# EAGLE design Etch-a-sketch (EAGLE 9.6.2)
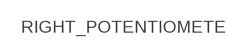
[diagram p0: schematic, sheet 1, part 1 of 2]
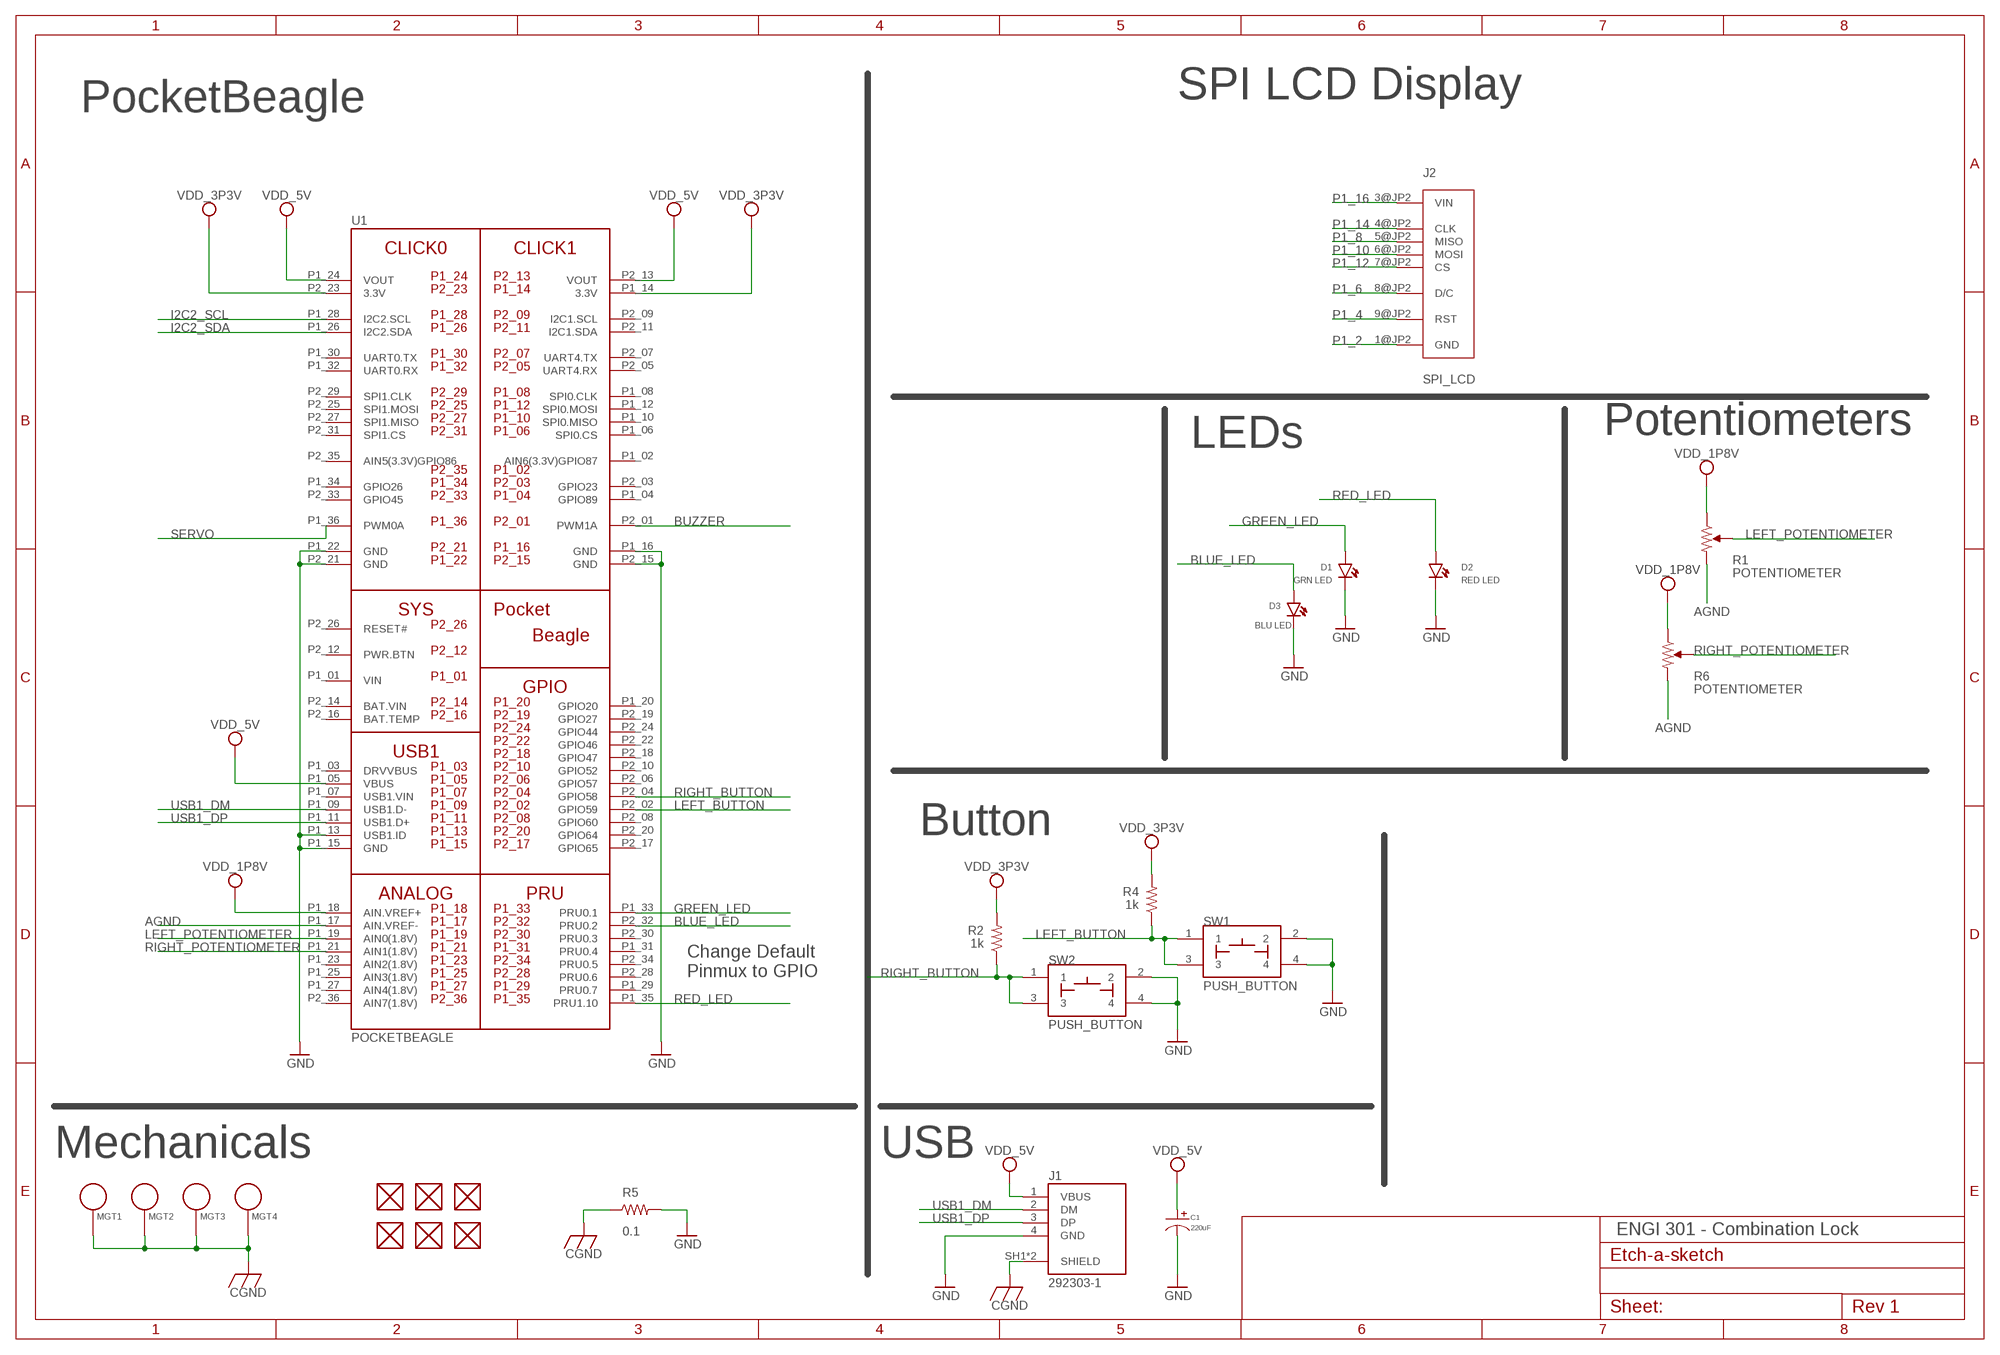
[diagram p1: schematic, sheet 1, part 2 of 2]

## Parts
C1  220uF  CAPACITOR_P_10MM  [CP10MM]
D1  GRN LED  LED  [EIA-STD]
D2  RED LED  LED  [EIA-STD]
D3  GRN LED  LED  [EIA-STD]
FUD1  FIDUCIAL  [FIDUCIAL_40MIL]
FUD2  FIDUCIAL  [FIDUCIAL_40MIL]
FUD3  FIDUCIAL  [FIDUCIAL_40MIL]
FUD4  FIDUCIAL  [FIDUCIAL_40MIL]
FUD5  FIDUCIAL  [FIDUCIAL_40MIL]
FUD6  FIDUCIAL  [FIDUCIAL_40MIL]
J1  292303-1  [TE_292303-1]
J2  SPI_LCD  [TFT_LCD_PCB]
MGT1  MOUNTING_HOLE  [MOUNTING_HOLE]
MGT2  MOUNTING_HOLE  [MOUNTING_HOLE]
MGT3  MOUNTING_HOLE  [MOUNTING_HOLE]
MGT4  MOUNTING_HOLE  [MOUNTING_HOLE]
R1  POTENTIOMETER  [POT-PO90S]
R2  1k  R_R0603  [R0603]
R4  1k  R_R0603  [R0603]
R5  0.1  R_R0805  [R0805]
R6  POTENTIOMETER  [POT-PO90S]
SW1  PUSH_BUTTON  [BUTTON_12.5MM]
SW2  PUSH_BUTTON  [BUTTON_12.5MM]
U1  POCKETBEAGLE  [POCKETBEAGLE]

## Nets
AGND: R1.CW R6.CW U1.P1_17(AIN.VREF-)
AGND1: U1.P1_21(AIN1(1.8V))
BUTTON1: U1.P2_04(GPIO58)
BUZZER: U1.P2_01(PWM1A)
CGND: J1.SH1(SHIELD) J1.SH2(SHIELD) MGT1.P$1 MGT2.P$1 MGT3.P$1 MGT4.P$1 R5.1
GND: C1.P$2 D1.CATHODE D2.CATHODE D3.CATHODE J1.4(GND) R5.2 SW1.2 SW1.4 SW2.2 SW2.4 U1.P1_13(USB1.ID) U1.P1_15(GND) U1.P1_16(GND) U1.P1_22(GND) U1.P2_15(GND) U1.P2_21(GND)
GREEN_LED: D1.ANODE D3.ANODE U1.P1_33(PRU0.1)
GREEN_LED1: U1.P2_32(PRU0.2)
I2C2_SCL: U1.P1_28(I2C2.SCL)
I2C2_SDA: U1.P1_26(I2C2.SDA)
LEFT_BUTTON: R2.1 R4.1 SW1.1 SW1.3 SW2.1 SW2.3 U1.P2_02(GPIO59)
LEFT_POTENTIOMETER: R1.S R6.S U1.P1_19(AIN0(1.8V))
N$1: J2.3@JP2(VIN)
N$2: J2.4@JP2(CLK)
N$3: J2.5@JP2(MISO)
N$4: J2.6@JP2(MOSI)
N$5: J2.7@JP2(CS)
N$6: J2.8@JP2(D/C)
N$7: J2.9@JP2(RST)
N$8: J2.1@JP2(GND)
RED_LED: D2.ANODE U1.P1_35(PRU1.10)
SERVO: U1.P1_36(PWM0A)
USB1_DM: J1.2(DM) U1.P1_09(USB1.D-)
USB1_DP: J1.3(DP) U1.P1_11(USB1.D+)
VDD_1P8V: R1.CCW R6.CCW U1.P1_18(AIN.VREF+)
VDD_3P3V: R2.2 R4.2 U1.P1_14(3.3V) U1.P2_23(3.3V)
VDD_5V: C1.P$1 J1.1(VBUS) U1.P1_05(VBUS) U1.P1_24(VOUT) U1.P2_13(VOUT)
Unconnected: FUD1.P$1 FUD2.P$1 FUD3.P$1 FUD4.P$1 FUD5.P$1 FUD6.P$1 U1.P1_02(AIN6(3.3V)GPIO87) U1.P1_03(DRVVBUS) U1.P1_04(GPIO89) U1.P1_06(SPI0.CS) U1.P1_07(USB1.VIN) U1.P1_08(SPI0.CLK) U1.P1_10(SPI0.MISO) U1.P1_12(SPI0.MOSI) U1.P1_20(GPIO20) U1.P1_23(AIN2(1.8V)) U1.P1_25(AIN3(1.8V)) U1.P1_27(AIN4(1.8V)) U1.P1_29(PRU0.7) U1.P1_30(UART0.TX) U1.P1_31(PRU0.4) U1.P1_32(UART0.RX) U1.P1_34(GPIO26) U1.P2_03(GPIO23) U1.P2_05(UART4.RX) U1.P2_06(GPIO57) U1.P2_07(UART4.TX) U1.P2_08(GPIO60) U1.P2_09(I2C1.SCL) U1.P2_10(GPIO52) U1.P2_11(I2C1.SDA) U1.P2_12(PWR.BTN) U1.P2_16(BAT.TEMP) U1.P2_17(GPIO65) U1.P2_18(GPIO47) U1.P2_19(GPIO27) U1.P2_20(GPIO64) U1.P2_22(GPIO46) U1.P2_24(GPIO44) U1.P2_25(SPI1.MOSI) U1.P2_26(RESET#) U1.P2_27(SPI1.MISO) U1.P2_28(PRU0.6) U1.P2_29(SPI1.CLK) U1.P2_30(PRU0.3) U1.P2_31(SPI1.CS) U1.P2_33(GPIO45) U1.P2_34(PRU0.5) U1.P2_35(AIN5(3.3V)GPIO86) U1.P2_36(AIN7(1.8V))

## Notes on the sheet
- PocketBeagle | SPI LCD Display
- P1_16
- P1_14
- P1_8
- P1_10
- P1_12
- P1_6
- P1_4
- P1_2
- LEDs | Potentiometers
- BLUE_LED
- BLU LED
- RIGHT_POTENTIOMETER
- RIGHT_BUTTON
- Button
- BLUE_LED
- RIGHT_POTENTIOMETER
- Change Default 
  Pinmux to GPIO
- RIGHT_BUTTON
- Mechanicals | USB
- ENGI 301 - Combination Lock
- RIGHT_POTENTIOMETER

## Power pins joined to a net without a drawn wire
BAT.VIN: U1.P2_14(BAT.VIN)
VIN: U1.P1_01(VIN)

## Library data of the parts
C1 = combo_lock:CAPACITOR_P: Library: MF_Passives Description: Device for Polarized Capacitors. Manufacture part number (MPN), Voltage Rating, and Tolerance can be added via Attributes. Check https://factory.macrofab.com/parts for the house parts list.; POPULATE: 1
D1-D3 = combo_lock:LED: EIA-STD LED, LTST-C191TBKT
FUD1-FUD6 = combo_lock:FIDUCIAL
J1 = combo_lock:292303-1: CONN USB RECEPT R/A TYPE A 4POS Check availability <https://pricing.snapeda.com/parts/292303-1/TE%20Connectivity/view-part?ref=eda>; AVAILABILITY: In Stock; CENTERLINE_PITCH: 2 mm[.078 in]; COMMENT: 292303-1; DESCRIPTION: Conn; Data; USB; Recept; 2.0; 4 Pos; 1 Port; Rt Angle; A Ser; Tin over Copper; EU_ROHS_COMPLIANCE: Compliant; MF: TE Connectivity; MP: 292303-1; NUMBER_OF_POSITIONS: 4; PACKAGE: None; PRICE: None; PRODUCT_TYPE: Connector; PURCHASE-URL: https://pricing.snapeda.com/search/part/292303-1/?ref=eda
J2 = Etch-a-sketch:SPI_LCD
MGT1-MGT4 = combo_lock:MOUNTING_HOLE: Chassis Mounting Hole w/GND connection ability
R1 R6 = combo_lock:POTENTIOMETER: Potentiometer - Examples: P090S-14T20BR10K (987-1277-ND)
R2 R4 R5 = combo_lock:R_: RESISTOR, American symbol
SW1 SW2 = combo_lock:PUSH_BUTTON
U1 = combo_lock:POCKETBEAGLE

## Board
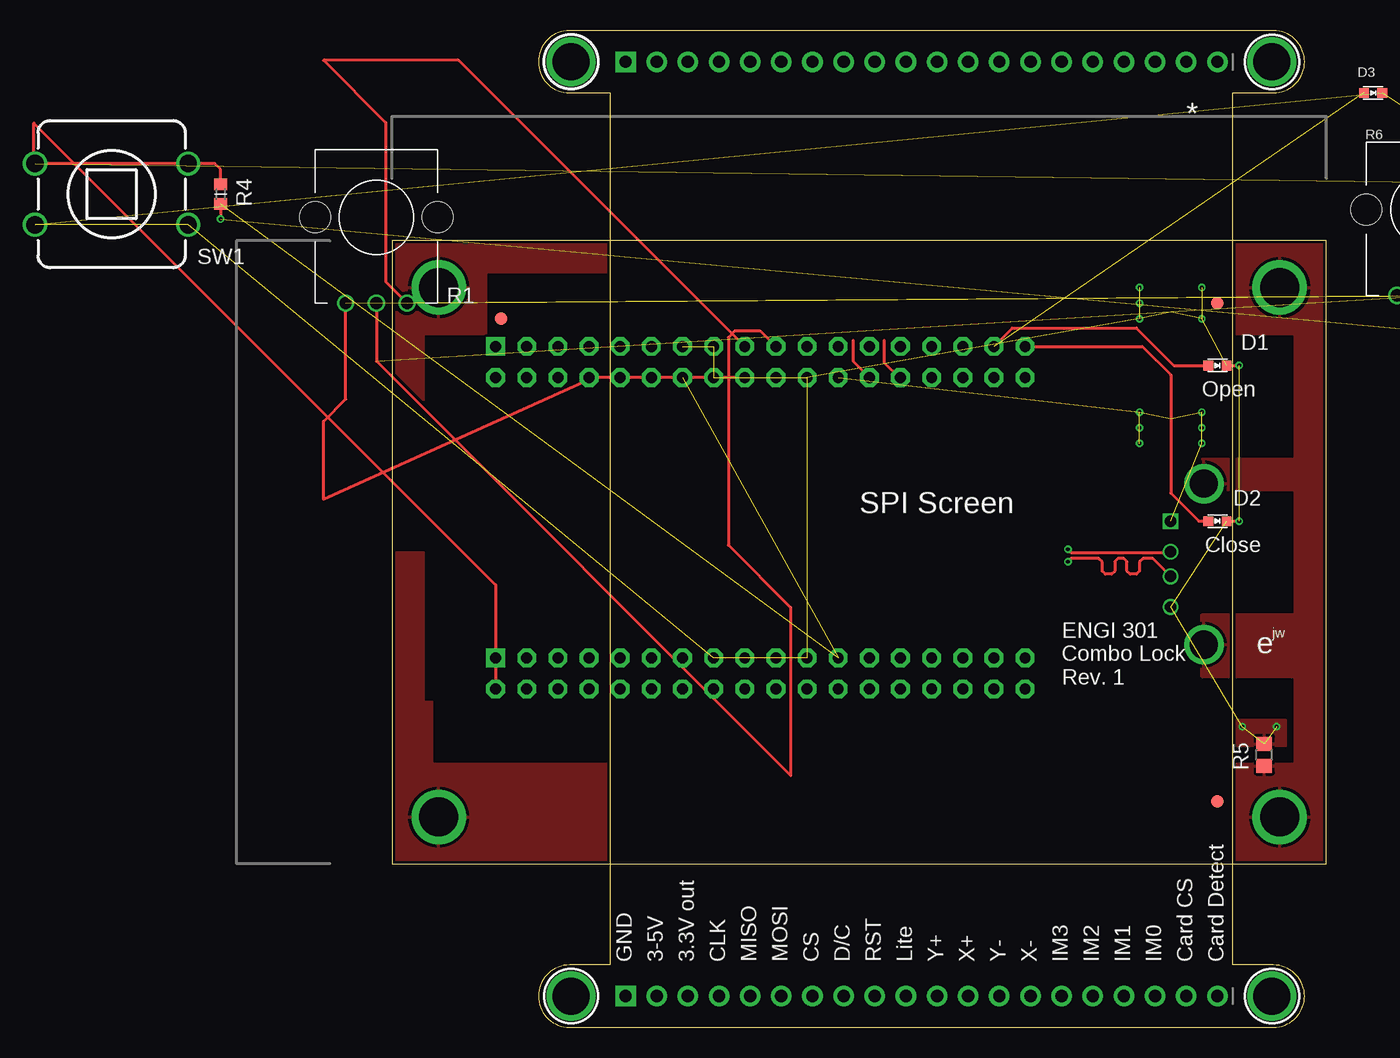
[diagram p2: board, top side]
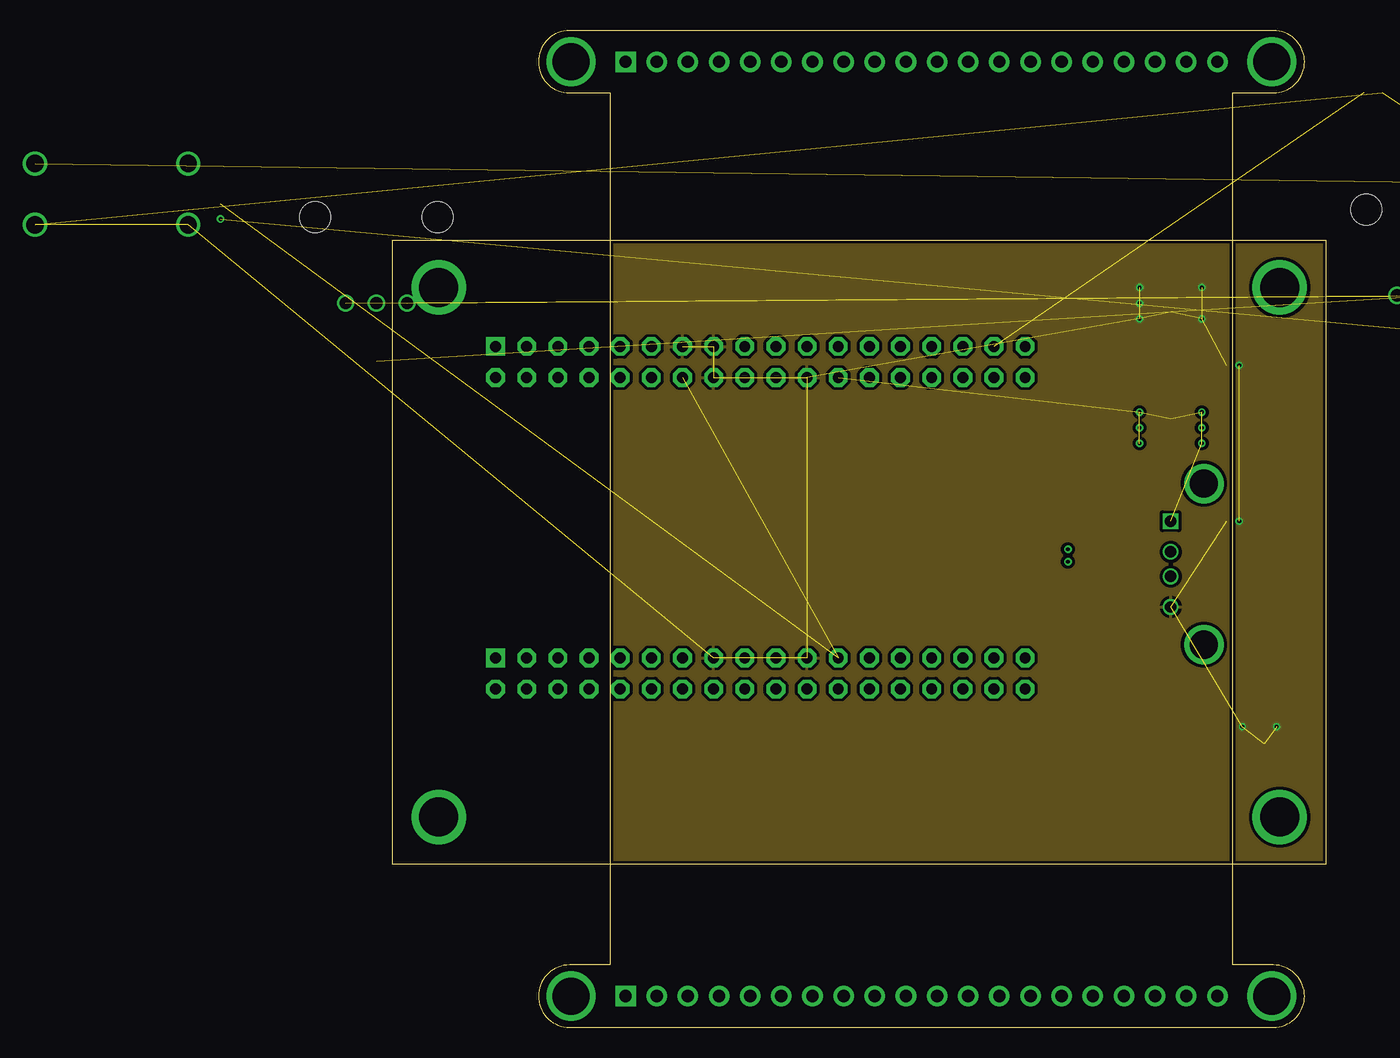
[diagram p3: board, inner layer Route2]
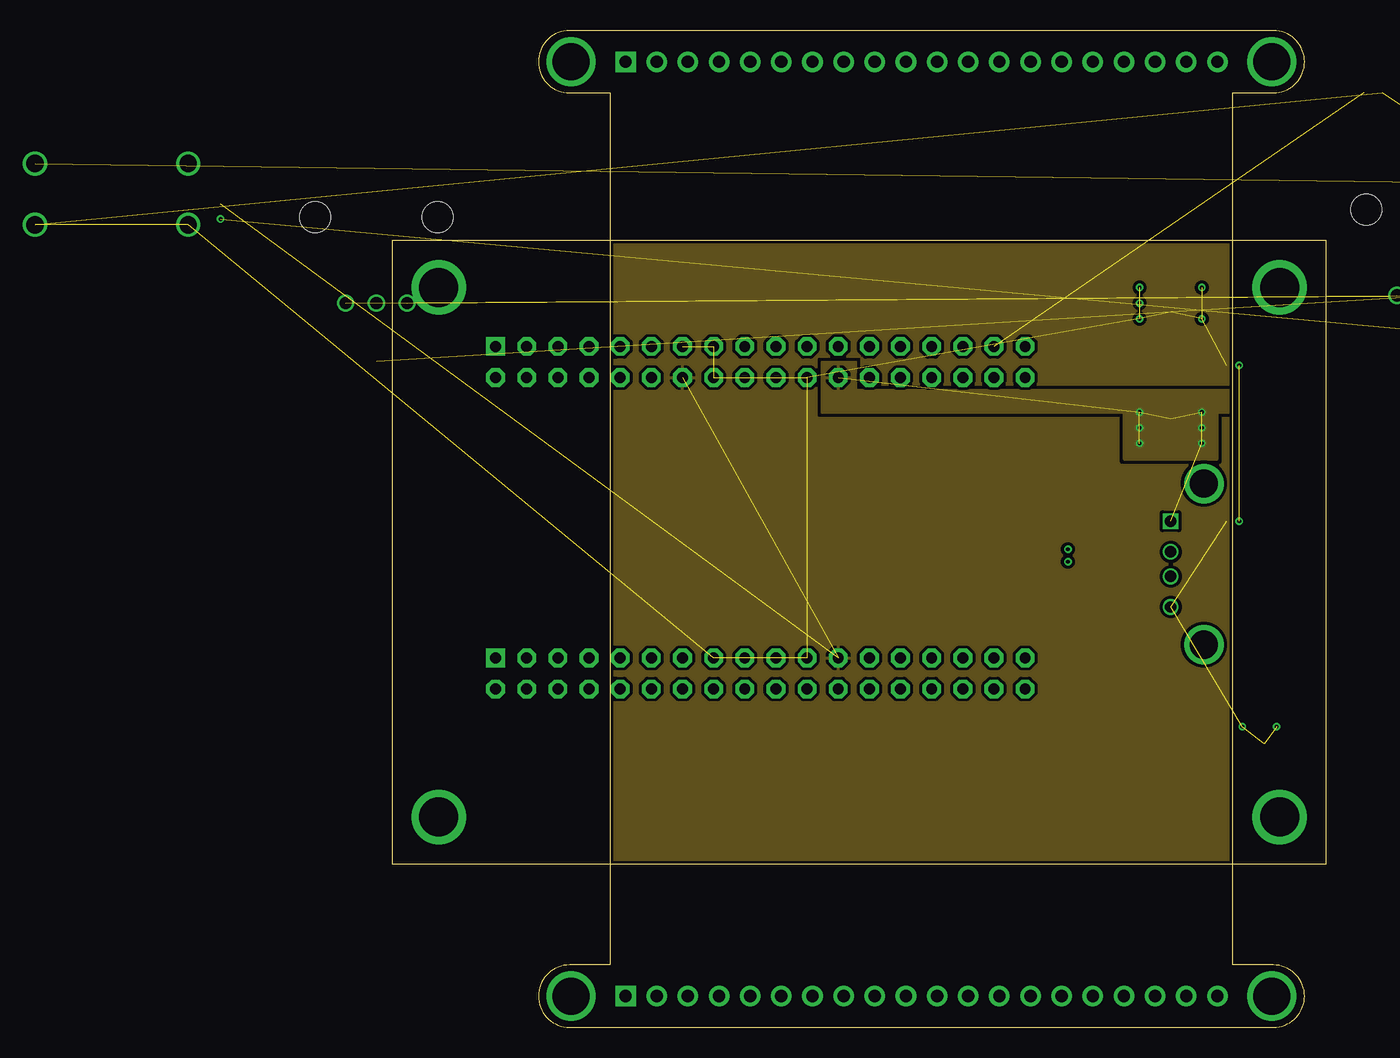
[diagram p4: board, inner layer Route15]
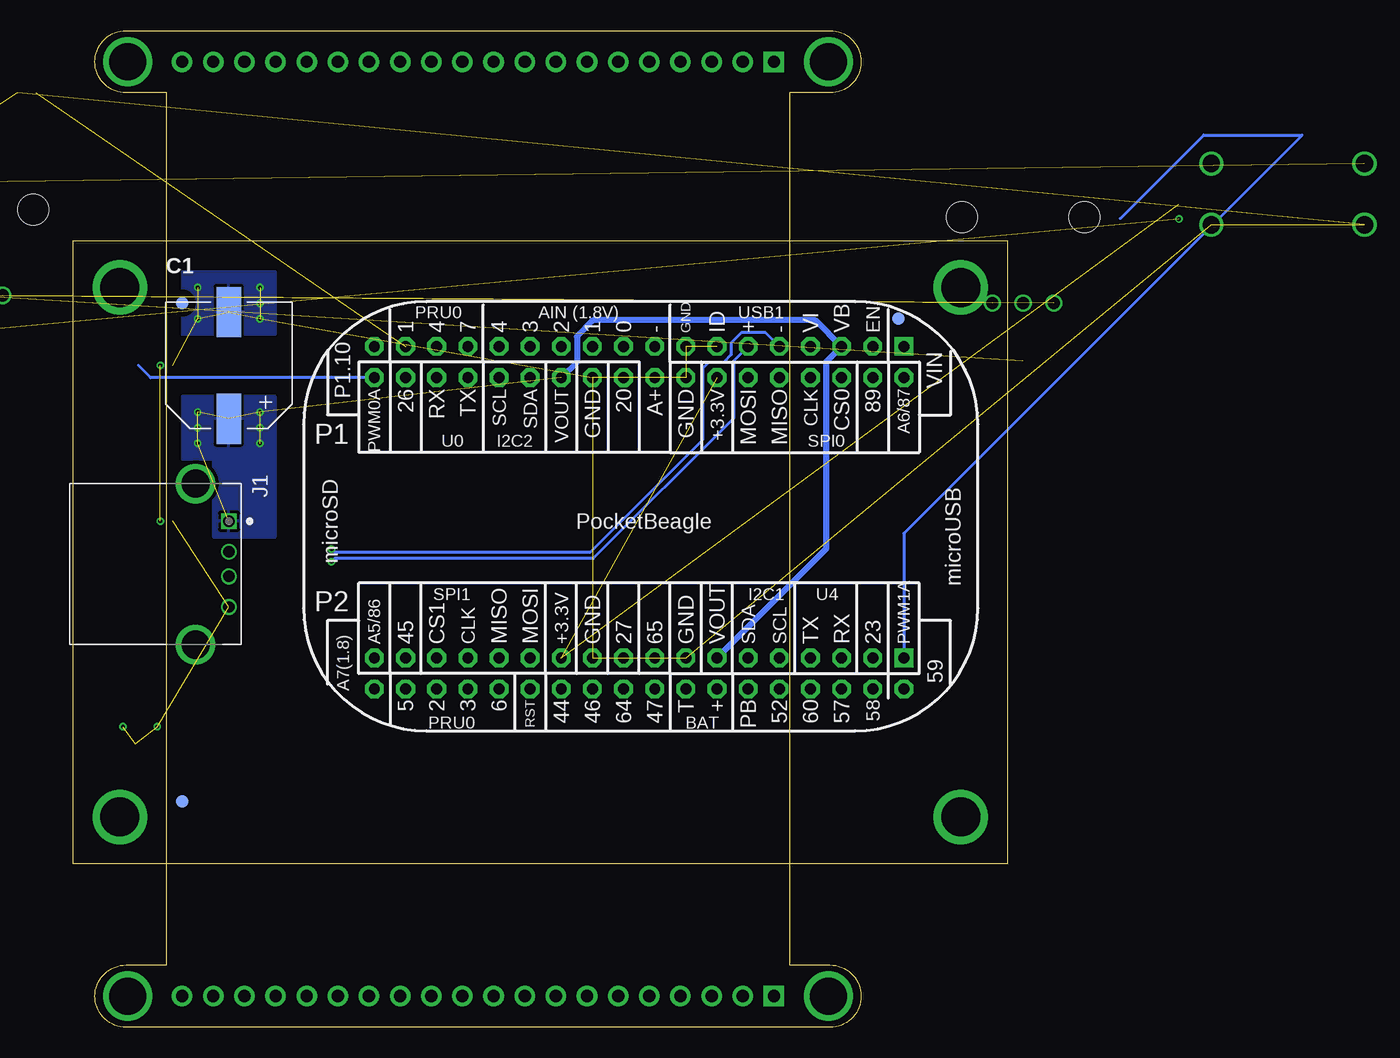
[diagram p5: board, bottom side, seen from below]

Size 76.2 x 81.28 mm. Coordinates in mm from the lower left corner, seen from the top.
Outline: 0,13.34 76.2,13.34 76.2,64.13 0,64.13 0,13.34
Copper layers (1*2*15*16): Top 0.035mm / dielectric 0.23mm / Route2 0.035mm / dielectric 0.93mm / Route15 0.035mm / dielectric 0.23mm / Bottom 0.035mm
Design rules "ENGI301_4lyr": minimum track width 10mil, minimum drill 12mil, track to track 10mil, track to pad 10mil, pad to pad 10mil, via to via 10mil, smd to smd 10mil, copper to edge 10mil, drill to drill 12mil, minimum pad ring 6mil, minimum via ring 6mil, stop-mask expansion 3mil, vias tented up to drill 25mil, thermal gap 10mil

### Footprints (pad centres in the part's own frame; a part is rotated, then mirrored left to right if it is on the bottom)
CP10MM = smd 2 x 4.1: P$1 0,-4.35; P$2 0,4.35
EIA-STD = smd 0.8 x 0.8: ANODE -0.75,0; CATHODE 0.75,0
FIDUCIAL_40MIL = smd 1.016 x 1.016: P$1 0,0
TE_292303-1 = drill 0.92 square: 1 0,0 | drill 0.92: 2 2.5,0; 3 4.5,0; 4 7,0 | drill 2.3: SH1 -3.07,-2.71; SH2 10.07,-2.71
TFT_LCD_PCB = drill 1 pad 1.676 square: 1@JP1 -24.13,38.1; 1@JP2 -24.13,-38.1 | drill 1 pad 1.676: 2@JP1 -21.59,38.1; 2@JP2 -21.59,-38.1; 3@JP1 -19.05,38.1; 3@JP2 -19.05,-38.1; 4@JP1 -16.51,38.1; 4@JP2 -16.51,-38.1; 5@JP1 -13.97,38.1; 5@JP2 -13.97,-38.1; 6@JP1 -11.43,38.1; 6@JP2 -11.43,-38.1; 7@JP1 -8.89,38.1; 7@JP2 -8.89,-38.1; 8@JP1 -6.35,38.1; 8@JP2 -6.35,-38.1; 9@JP1 -3.81,38.1; 9@JP2 -3.81,-38.1; 10@JP1 -1.27,38.1; 10@JP2 -1.27,-38.1; 11@JP1 1.27,38.1; 11@JP2 1.27,-38.1; 12@JP1 3.81,38.1; 12@JP2 3.81,-38.1; 13@JP1 6.35,38.1; 13@JP2 6.35,-38.1; 14@JP1 8.89,38.1; 14@JP2 8.89,-38.1; 15@JP1 11.43,38.1; 15@JP2 11.43,-38.1; 16@JP1 13.97,38.1; 16@JP2 13.97,-38.1; 17@JP1 16.51,38.1; 17@JP2 16.51,-38.1; 18@JP1 19.05,38.1; 18@JP2 19.05,-38.1; 19@JP1 21.59,38.1; 19@JP2 21.59,-38.1; 20@JP1 24.13,38.1; 20@JP2 24.13,-38.1 | drill 3 pad 3.6: P$1@U$7 -28.575,-38.1; P$1@U$15 28.575,-38.1; P$1@U$16 -28.575,38.1; P$1@U$17 28.575,38.1
MOUNTING_HOLE = drill 3.175 pad 4.445: P$1 0,0
POT-PO90S = drill 1: CCW -2.5,0; CW 2.5,0; S 0,0 | hole 2.5: -5,7; 5,7
R0603 = smd 0.95 x 1.031: 1 -0.8,0; 2 0.8,0
R0805 = smd 1.143 x 1.27: 1 -0.889,0; 2 0.889,0
BUTTON_12.5MM = drill 1.4: 1 -6.25,2.5; 2 -6.25,-2.5; 3 6.25,2.5; 4 6.25,-2.5
POCKETBEAGLE = drill 0.889 pad 1.524 square: P1_01 5.91,3.53; P2_01 5.91,28.93 | drill 0.889 pad 1.524 octagon: P1_02 5.91,6.07; P1_03 8.45,3.53; P1_04 8.45,6.07; P1_05 10.99,3.53; P1_06 10.99,6.07; P1_07 13.53,3.53; P1_08 13.53,6.07; P1_09 16.07,3.53; P1_10 16.07,6.07; P1_11 18.61,3.53; P1_12 18.61,6.07; P1_13 21.15,3.53; P1_14 21.15,6.07; P1_15 23.69,3.53; P1_16 23.69,6.07; P1_17 26.23,3.53; P1_18 26.23,6.07; P1_19 28.77,3.53; P1_20 28.77,6.07; P1_21 31.31,3.53; P1_22 31.31,6.07; P1_23 33.85,3.53; P1_24 33.85,6.07; P1_25 36.39,3.53; P1_26 36.39,6.07; P1_27 38.93,3.53; P1_28 38.93,6.07; P1_29 41.47,3.53; P1_30 41.47,6.07; P1_31 44.01,3.53; P1_32 44.01,6.07; P1_33 46.55,3.53; P1_34 46.55,6.07; P1_35 49.09,3.53; P1_36 49.09,6.07; P2_02 5.91,31.47; P2_03 8.45,28.93; P2_04 8.45,31.47; P2_05 10.99,28.93; P2_06 10.99,31.47; P2_07 13.53,28.93; P2_08 13.53,31.47; P2_09 16.07,28.93; P2_10 16.07,31.47; P2_11 18.61,28.93; P2_12 18.61,31.47; P2_13 21.15,28.93; P2_14 21.15,31.47; P2_15 23.69,28.93; P2_16 23.69,31.47; P2_17 26.23,28.93; P2_18 26.23,31.47; P2_19 28.77,28.93; P2_20 28.77,31.47; P2_21 31.31,28.93; P2_22 31.31,31.47; P2_23 33.85,28.93; P2_24 33.85,31.47; P2_25 36.39,28.93; P2_26 36.39,31.47; P2_27 38.93,28.93; P2_28 38.93,31.47; P2_29 41.47,28.93; P2_30 41.47,31.47; P2_31 44.01,28.93; P2_32 44.01,31.47; P2_33 46.55,28.93; P2_34 46.55,31.47; P2_35 49.09,28.93; P2_36 49.09,31.47

### Placement (x,y rotation side)
C1  63.5,53.98 0 bottom
D1  67.31,53.98 0 top
D2  67.31,41.28 0 top
D3  80.01,76.2 0 top  (outside the outline)
FUD1  67.31,59.05 0 top
FUD2  67.31,18.41 0 top
FUD3  8.89,57.79 0 bottom
FUD4  67.31,59.05 0 bottom
FUD5  67.31,18.41 0 bottom
FUD6  8.89,57.79 0 top
J1  63.5,41.28 270 bottom
J2  43.18,40.64 0 top
MGT1  3.81,60.33 0 top
MGT2  3.81,17.14 0 top
MGT3  72.39,17.14 0 top
MGT4  72.39,60.33 0 top
R1  -1.27,59.05 0 top
R2  100.33,55.24 0 top  (outside the outline)
R4  -13.97,67.94 270 top  (outside the outline)
R5  71.12,22.23 90 top
R6  84.45,59.69 0 top  (outside the outline)
SW1  -22.86,67.94 0 top  (outside the outline)
SW2  106.05,66.04 0 top  (outside the outline)
U1  2.54,59.05 180 bottom

### Tracks (layer width: path | path; a pad name or v marks a point on that pad's centre or on a via)
AGND  (1 unrouted)
  Top 0.254: R1.CW -0.51,60.79 -0.51,73.79 -5.59,78.87 5.43,78.87 U1.P1_17
BUZZER
  Bottom 0.254: U1.P2_01 8.45,40.28 -24.04,72.77 -16,72.77 -9.2,65.97
CGND
  pour Top: -2.54,10.8 -2.54,38.73 2.54,38.73 2.54,26.54 3.24,26.54 3.24,21.46 68.58,21.46 73.66,21.46 73.66,28.58 66.04,28.58 66.04,33.66 72.39,33.66 73.66,33.66 73.66,34.92 73.66,38.73 78.74,38.73 78.74,10.8
  pour Top: -2.54,38.73 -2.54,66.68 78.74,66.68 78.74,38.73 73.66,38.73 73.66,43.81 66.04,43.81 66.04,46.36 73.66,46.36 73.66,56.52 68.58,56.52 68.58,61.59 7.62,61.59 7.62,56.52 2.54,56.52 2.54,38.73
GND  (via drill 0.3 pad 0.61)  (22 unrouted)
  Top 0.254: D2.CATHODE v69.09,41.28 | D1.CATHODE v69.09,53.98
  other vias: 69.34,24.51 72.14,24.51 60.96,60.33 60.96,59.05 60.96,57.79 66.04,57.79 66.04,60.33
  pour Route2: -5.08,69.22 78.74,69.22 81.28,69.22 81.28,8.26 -5.08,8.26
  pour Top: 68.58,22.99 72.9,22.99 72.9,25.02 68.58,25.02
  pour Bottom: 59.69,56.52 59.69,61.59 67.31,61.59 67.31,56.52
GREEN_LED  (1 unrouted)
  Top 0.254: U1.P1_33 50.59,57.02 60.71,57.02 63.75,53.98 D1.ANODE
I2C2_SCL
  Top 0.254: 40.13,56.01 40.13,54.23 41.38,52.98 U1.P1_28 41.4,52.92
I2C2_SDA
  Top 0.254: U1.P1_26 38.86,53.05 38.78,53.13 37.59,54.32 37.59,56.01
LEFT_BUTTON  (3 unrouted)
  Top 0.254: R4.1 -13.97,69.98 -14.44,70.44 SW1.3 SW1.1 -29.21,70.55 -29.21,73.75 8.45,36.09 U1.P2_02
LEFT_POTENTIOMETER  (1 unrouted)
  Top 0.254: U1.P1_19 30.07,56.77 27.94,56.77 27.43,56.26 27.43,39.33 32.51,34.25 32.51,20.53 -1.27,54.31 R1.S
RED_LED
  Top 0.254: U1.P1_35 61.19,55.52 63.5,53.21 63.5,43.56 65.79,41.28 D2.ANODE
SERVO
  Bottom 0.254: U1.P1_36 69.88,52.98 70.87,53.98
USB1_DM  (via drill 0.3 pad 0.61)
  Top 0.254: v55.12,38.99 55.37,38.73 63.46,38.73 J1.2
  Bottom 0.254: U1.P1_09 19.75,56.67 21.69,56.67 22.55,55.81 22.55,54.85 23.16,54.23 24.38,54.23 24.89,53.72 24.89,47.88 34.04,38.73 54.86,38.73 v55.12,38.99
USB1_DP  (via drill 0.3 pad 0.61)
  Top 0.254: v55.12,37.97 55.37,38.23 57.66,38.23 57.91,37.97 57.91,37.21 58.17,36.96 58.67,36.96 58.93,37.21 58.93,37.97 59.18,38.23 59.69,38.23 59.94,37.97 59.94,37.21 60.2,36.96 60.71,36.96 60.96,37.21 60.96,37.97 61.21,38.23 62.05,38.23 J1.3
  Bottom 0.254: U1.P1_11 22.35,54.32 22.35,49.66 33.78,38.23 54.86,38.23 v55.12,37.97
VDD_1P8V  (1 unrouted)
  Top 0.254: U1.P1_18 16.48,52.98 -5.59,43.05 -5.59,49.4 -3.77,51.22 R1.CCW
VDD_3P3V  (via drill 0.3 pad 0.61)  (3 unrouted)
  Top 0.254: R4.2 v-13.97,65.91
  pour Route15 (rank 6): -7.62,71.75 83.82,71.75 83.82,5.72 -7.62,5.72
VDD_5V  (via drill 0.3 pad 0.61)  (8 unrouted)
  Bottom 0.508: U1.P2_13 14.8,39.02 14.8,54.26 U1.P1_05 15.66,57.66 33.78,57.66 35.12,56.32 35.12,54.26 U1.P1_24
  other vias: 60.96,50.16 66.04,50.16 66.04,48.9 66.04,47.62 60.96,48.9 60.96,47.62
  pour Route15: 35.05,54.23 35.05,50.16 59.69,50.16 59.69,46.36 67.31,46.36 67.31,50.16 73.91,50.16 73.91,52.7 70.87,52.7 70.87,51.94 37.85,51.94 37.85,54.23
  pour Bottom: 59.69,40.01 59.69,51.44 67.31,51.44 67.31,46.36 64.77,46.36 64.77,40.01

### Text on the board
tPlace: Open | Close | jw | ENGI 301 / Combo Lock | e | Rev. 1